# Altium project DRV8801_MODULE.PrjPcb
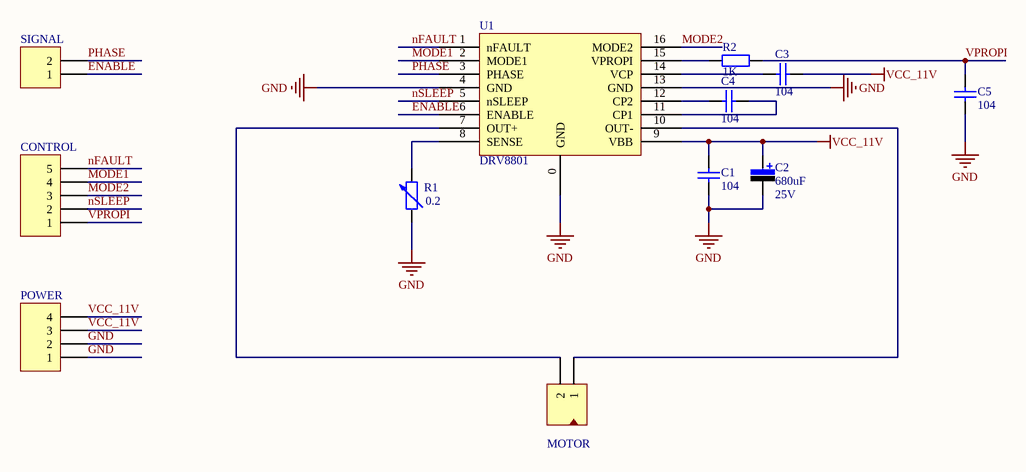
[diagram p0: DRV8801.SchDoc]
1 sheet, 12 parts. Net scope: global (net labels, ports and power ports of the same name join across sheets).
Board file: DRV8801.PcbDoc

## Sheet DRV8801.SchDoc
size A

### Parts
C1  value 104  [C-0603]  (hidden comment: Cap-S)
C2  value 680uF  Vol: 25V  [C-RB-5.0/10]  (hidden comment: Cap-Pol-ER)
C3  value 104  [C-0603]  (hidden comment: Cap-S)
C4  value 104  [C-0603]  (hidden comment: Cap-S)
C5  value 104  [C-0603]  (hidden comment: Cap-S)
CONTROL  Header 5  [HDR1X5]  (value not drawn)
MOTOR  Header 2  [HDR2X1-2.54]  (value not drawn)
POWER  Header 4  [HDR1X4]  (value not drawn)
R1  value 0.2  [AXIAL-0.6]  (hidden comment: Res Adj2)
R2  value 1K  [0603-1]  (hidden comment: Res1)
SIGNAL  Header 2  [HDR1X2]  (value not drawn)
U1  DRV8801  [HTSSOP16]

### Nets
GND: C1.1 C2.2 C5.1 POWER.1 POWER.2 R1.1 U1.0(GND) U1.4(GND) U1.13(GND)
VCC_11V: C1.2 C2.1 C3.1 POWER.3 POWER.4 U1.9(VBB)
ENABLE: SIGNAL.1 U1.6(ENABLE)
MODE1: CONTROL.4 U1.2(MODE1)
MODE2: CONTROL.3 U1.16(MODE2)
nFAULT: CONTROL.5 U1.1(nFAULT)
nSLEEP: CONTROL.2 U1.5(nSLEEP)
PHASE: SIGNAL.2 U1.3(PHASE)
VPROPI: C5.2 CONTROL.1 R2.2
NetC3_2: C3.2 U1.14(VCP)
NetC4_1: C4.1 U1.11(CP1)
NetC4_2: C4.2 U1.12(CP2)
NetMOTOR_1: MOTOR.1 U1.10(OUT-)
NetMOTOR_2: MOTOR.2 U1.7(OUT+)
NetR1_2: R1.2 U1.8(SENSE)
NetR2_1: R2.1 U1.15(VPROPI)

### Library data of the parts
C1 C3-C5 = Cap-S: 贴片瓷片电容; Published: 8-Jun-2000; LatestRevisionDate: 17-Jul-2002; LatestRevisionNote: Re-released for DXP Platform.; PackageReference: RAD-0.3; Publisher: Altium Limited
C2 = Cap-Pol-ER: 插件电解电容; Published: 8-Jun-2000; LatestRevisionDate: 17-Jul-2002; LatestRevisionNote: Re-released for DXP Platform.; PackageReference: RB7.6-15; Publisher: Altium Limited
CONTROL = Header 5: Header, 5-Pin; LatestRevisionDate: 17-Jul-2002; LatestRevisionNote: Re-released for DXP Platform.; Publisher: Altium Limited
MOTOR = Header 2: 接插件; LatestRevisionDate: 17-Jul-2002; LatestRevisionNote: Re-released for DXP Platform.; Publisher: Altium Limited
POWER = Header 4: Header, 4-Pin; LatestRevisionDate: 17-Jul-2002; LatestRevisionNote: Re-released for DXP Platform.; Publisher: Altium Limited
R1 = Res Adj2: Variable Resistor; Set Position: 0.5; Published: 8-Jun-2000; LatestRevisionDate: 17-Jul-2002; LatestRevisionNote: Re-released for DXP Platform.; PackageReference: AXIAL-0.6; Publisher: Altium Limited; PackageDescription: Axial Device, Thru-Hole; 2 Leads; 0.6 in Pin Spacing
R2 = Res1: 贴片电阻; Published: 8-Jun-2000; LatestRevisionDate: 17-Jul-2002; LatestRevisionNote: Re-released for DXP Platform.; PackageReference: AXIAL-0.4; Publisher: Altium Limited
SIGNAL = Header 2: Header, 2-Pin; LatestRevisionDate: 17-Jul-2002; LatestRevisionNote: Re-released for DXP Platform.; Publisher: Altium Limited